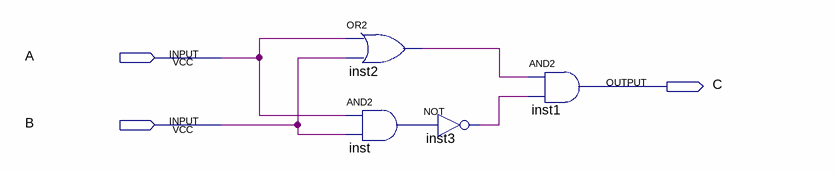
[diagram p0: schematic sheet]
// Quartus schematic 1-bit-xor.bdf as structural Verilog: 4 symbols, 3 pins
module \1-bit-xor  (
  input  A,
  input  B,
  output C
);

  wire inst2_out, inst3_out, inst_out;

  or inst2 (inst2_out, A, B);
  and inst (inst_out, A, B);
  not inst3 (inst3_out, inst_out);
  and inst1 (C, inst2_out, inst3_out);
endmodule
